# EAGLE design MicroStepper375 (EAGLE 8.3.0)
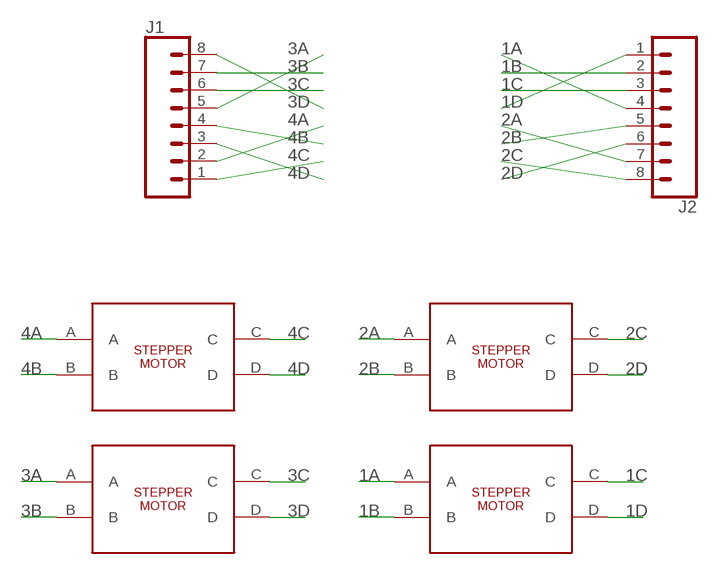
[diagram p0: schematic, sheet 1]

## Parts
J1  CONN_08NO_SILK_FEMALE_PTH  [1X08_NO_SILK]
J2  CONN_08NO_SILK_FEMALE_PTH  [1X08_NO_SILK]
U$1  MICRO_STEPPER_375X375  [MICRO_STEPPER_375X375]
U$2  MICRO_STEPPER_375X375  [MICRO_STEPPER_375X375]
U$3  MICRO_STEPPER_375X375  [MICRO_STEPPER_375X375]
U$4  MICRO_STEPPER_375X375  [MICRO_STEPPER_375X375]

## Nets
1A: J2.4 U$4.A
1B: J2.2 U$4.B
1C: J2.3 U$4.C
1D: J2.1 U$4.D
2A: J2.7 U$3.A
2B: J2.5 U$3.B
2C: J2.8 U$3.C
2D: J2.6 U$3.D
3A: J1.5 U$2.A
3B: J1.7 U$2.B
3C: J1.6 U$2.C
3D: J1.8 U$2.D
4A: J1.2 U$1.A
4B: J1.4 U$1.B
4C: J1.1 U$1.C
4D: J1.3 U$1.D

## Library data of the parts
J1 J2 = SparkFun-Connectors:CONN_08: Multi connection point. Often used as Generic Header-pin footprint for 0.1 inch spaced/style header connections On any of the 0.1 inch spaced packages, you can populate with these: Break Away Headers - Straight <https://www.sparkfun.com/products/116> (PRT-00116) Break Away Male Headers - Right Angle <https://www.sparkfun.com/products/553> (PRT-00553) Female Headers <https://www.sparkfun.com/products/115> (PRT-00115) Break Away Headers - Machine Pin <https://www.sparkfun.com/products/117> (PRT-00117) Break Away Female Headers - Swiss Machine Pin <https://www.sparkfun.com/products/743> (PRT-00743) Arduino Stackable Header - 8 Pin <https://www.sparkfun.com/products/9279> (PRT-09279) For SCREWTERMINALS and SPRING TERMINALS visit here: Screw Terimnals on SparkFun.com <https://www.sparkfun.com/search/results?term=Screw+Terminals> (5mm/3.5mm/2.54mm spacing) This device is also useful as a general connection point to wire up your design to another part of your project. Our various solder wires solder well into these plated through hole pads. Hook-Up Wire - Assortment (Stranded, 22 AWG) <https://www.sparkfun.com/products/11375> (PRT-11375) Hook-Up Wire - Assortment (Solid Core, 22 AWG) <https://www.sparkfun.com/products/11367> (PRT-11367) View the entire wire category on our website here <https://www.sparkfun.com/categories/141> Special notes: Molex polarized connector foot print use with SKU : PRT-08231 with associated crimp pins and housings. 1MM SMD Version SKU: PRT-10208 NOTES ON THE VARIANTS LOCK and LOCK_LONGPADS... This footprint was designed to help hold the alignment of a through-hole component (i.e. 6-pin header) while soldering it into place. You may notice that each hole has been shifted either up or down by 0.005 of an inch from it's more standard position (which is a perfectly straight line). This slight alteration caused the pins (the squares in the middle) to touch the edges of the holes. Because they are alternating, it causes a "brace" to hold the component in place. 0.005 has proven to be the perfect amount of "off-center" position when using our standard breakaway headers. Although looks a little odd when you look at the bare footprint, once you have a header in there, the alteration is very hard to notice. Also,if you push a header all the way into place, it is covered up entirely on the bottom side.; PROD_ID: CONN-08438
U$1-U$4 = Ladvien_Eagle_Parts:MICRO_STEPPER_375X375

## Board
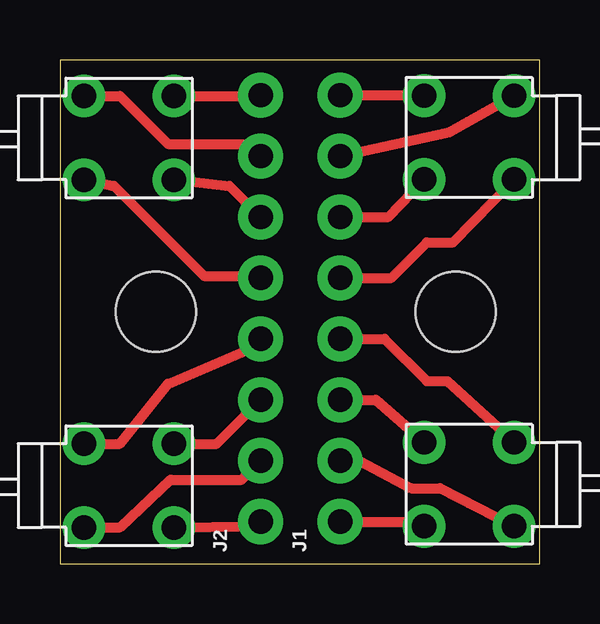
[diagram p1: board, top side]

Size 20 x 21 mm. Coordinates in mm from the lower left corner, seen from the top.
Outline: 0,0 20,0 20,21 0,21 0,0
Copper layers (1*16): Top 0.035mm / dielectric 1.5mm / Bottom 0.035mm
Design rules "default": minimum track width 6mil, minimum drill 0.35mm, track to track 6mil, track to pad 6mil, pad to pad 6mil, via to via 6mil, smd to smd 6mil, copper to edge 40mil, drill to drill 6mil, minimum pad ring 10mil, minimum via ring 8mil, stop-mask expansion 4mil, vias tented up to drill 0mil, thermal gap 10mil
Holes 3.35 mm at 4,10.5 16.5,10.5

### Footprints (pad centres in the part's own frame; a part is rotated, then mirrored left to right if it is on the bottom)
1X08_NO_SILK = drill 1.016 pad 1.88: 1 0,0; 2 2.54,0; 3 5.08,0; 4 7.62,0; 5 10.16,0; 6 12.7,0; 7 15.24,0; 8 17.78,0
MICRO_STEPPER_375X375 = drill 1.016 pad 1.778: A 0,0; B 3.496,0; C 0,3.75; D 3.496,3.75

### Placement (x,y rotation side)
J1  11.68,1.75 90 top
J2  8.37,1.75 90 top
U$1  18.94,1.55 90 top
U$2  18.94,16.02 90 top
U$3  1,19.5 270 top
U$4  1,5 270 top

### Tracks (layer width: path | path; a pad name or v marks a point on that pad's centre or on a via)
1A
  Top 0.406: U$4.A 2.5,5 4.5,7.5 8,9 J2.4
1B
  Top 0.406: U$4.B 2.52,1.51 4.62,3.5 7.58,3.5 J2.2
1C
  Top 0.406: U$4.C 6.54,5 J2.3
1D
  Top 0.406: U$4.D 7.87,1.55 J2.1
2A
  Top 0.406: U$3.A 2.5,19.5 4.5,17.5 7.86,17.5 J2.7
2B
  Top 0.406: U$3.B 2.25,15.75 6,12 8.28,12 J2.5
2C
  Top 0.406: U$3.C 8.34,19.5 J2.8
2D
  Top 0.406: U$3.D 7.07,15.75 J2.6
3A
  Top 0.406: J1.5 13.82,11.91 15.3,13.39 16.39,13.39 U$2.A
3B
  Top 0.406: J1.7 16.24,17.99 U$2.B
3C
  Top 0.406: J1.6 13.7,14.45 U$2.C
3D
  Top 0.406: J1.8 14.97,19.53 U$2.D
4A
  Top 0.406: J1.2 12.49,4.29 14.64,3.14 15.86,3.14 U$1.A
4B
  Top 0.406: U$1.B 16.14,7.61 15.3,7.61 13.54,9.37 J1.4
4C
  Top 0.406: J1.1 14.5,1.75 U$1.C
4D
  Top 0.406: J1.3 13.17,6.83 U$1.D